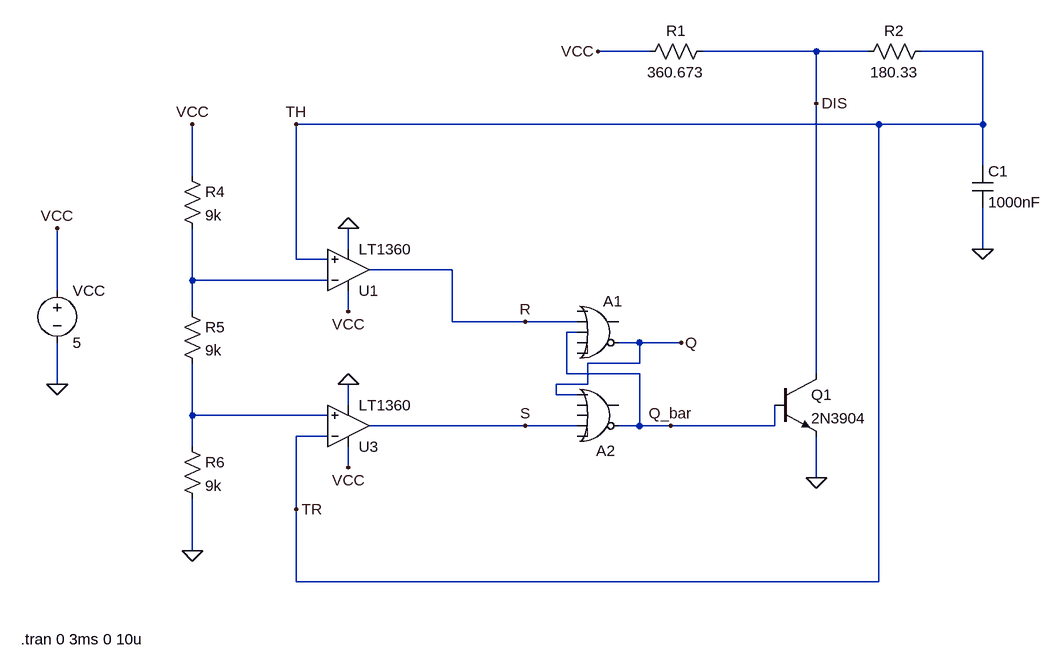
[diagram p0: schematic q1_astable.asc]
* q1_astable.asc
R4 VCC N001 9k
R5 N001 N002 9k
R6 N002 0 9k
VCC VCC 0 5
A1 0 R Q_bar 0 0 Q 0 0 OR Vhigh=5 Vlow=0 Ref=1.0
A2 Q 0 0 S 0 Q_bar 0 0 OR Vhigh=5 Vlow=0 Ref=1.0
R1 DIS VCC 360.673
* U1: LT1360 (symbol OpAmps\LT1360 not available, pins judged from their places): In+=TR In-=N001 V+=VCC V-=0 OUT=R
* U3: LT1360 (symbol OpAmps\LT1360 not available, pins judged from their places): In+=N002 In-=TR V+=VCC V-=0 OUT=S
Q1 DIS Q_bar 0 0 2N3904
R2 TR DIS 180.33
C1 TR 0 1000nF
.model NPN NPN
.model PNP PNP
.lib standard.bjt
.tran 0 3ms 0 10u
.backanno
.end

* Results of the author's LTspice run, read from the files saved beside the schematic
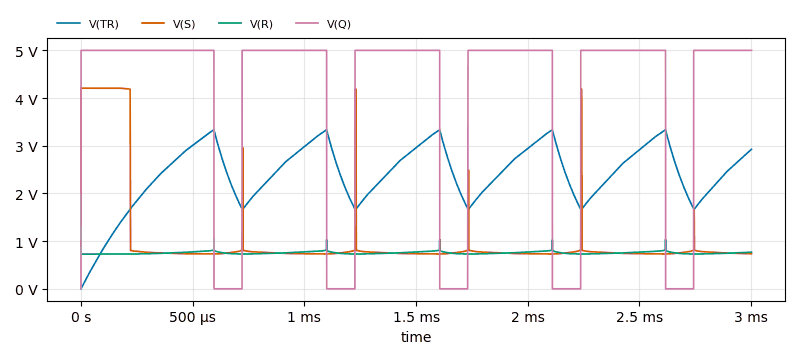
[diagram p1: Transient Analysis of q1_astable.asc, plotted from the saved traces]
* Transient Analysis, 1 run:
*   V(TR): min 18.76 µV, max 3.335 V, average 2.4 V, rms 2.491 V, last 2.926 V
*   V(S): min 728 mV, max 4.22 V, average 1.02 V, rms 1.37 V, last 735.2 mV
*   V(R): min 726.9 mV, max 1.977 V, average 752.8 mV, rms 753.2 mV, last 767.3 mV
*   V(Q): min 0 V, max 5 V, average 3.949 V, rms 4.443 V, last 5 V